# Altium schematic sheet SR_latch.SchDoc
size A4
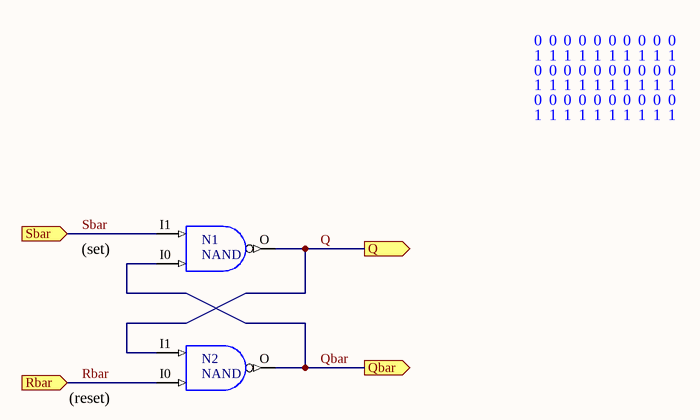
[diagram p0: SR_latch.SchDoc]

## Parts
N1  NAND
N2  NAND

## Ports
Q (out), Qbar (out), Rbar (in), Sbar (in)

## Nets
Q: N1.O N2.I1 ; port Q
Qbar: N1.I0 N2.O ; port Qbar
Rbar: N2.I0 ; port Rbar
Sbar: N1.I1 ; port Sbar

## Notes on the sheet
- 0
- 1
- (set)
- (reset)

## Library data of the parts
N1 N2 = NAND2: 2-Input NAND Gate; FPGAVendor: CUPL; Published: 17-Apr-2002; Publisher: Altium Limited